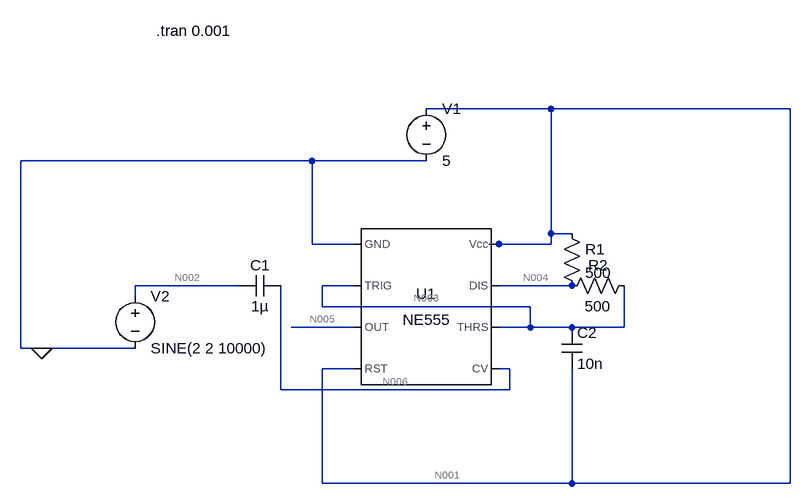
[diagram p0: schematic Draft10.asc]
Draft10.asc, the LTspice schematic file:
Version 4
SHEET 1 1044 680
WIRE 672 -32 480 -32
WIRE 1040 -32 672 -32
WIRE 304 48 -144 48
WIRE 480 48 304 48
WIRE 672 160 672 -32
WIRE 704 160 672 160
WIRE 304 176 304 48
WIRE 368 176 304 176
WIRE 592 176 576 176
WIRE 672 176 672 160
WIRE 672 176 592 176
WIRE 192 240 32 240
WIRE 368 240 320 240
WIRE 704 240 592 240
WIRE 32 256 32 240
WIRE 320 272 320 240
WIRE 640 272 320 272
WIRE 368 304 272 304
WIRE 640 304 640 272
WIRE 640 304 592 304
WIRE 704 304 640 304
WIRE 784 304 784 240
WIRE 784 304 704 304
WIRE -144 336 -144 48
WIRE -112 336 -144 336
WIRE 32 336 -112 336
WIRE 368 368 320 368
WIRE 608 368 592 368
WIRE 256 400 256 240
WIRE 608 400 608 368
WIRE 608 400 256 400
WIRE 320 544 320 368
WIRE 704 544 704 368
WIRE 704 544 320 544
WIRE 1040 544 1040 -32
WIRE 1040 544 704 544
FLAG -112 336 0
SYMBOL Misc/NE555 480 272 R0
SYMATTR InstName U1
SYMBOL voltage 480 -48 R0
SYMATTR InstName V1
SYMATTR Value 5
SYMBOL voltage 32 240 R0
SYMATTR InstName V2
SYMATTR Value SINE(2 2 10000)
SYMBOL cap 256 224 R90
WINDOW 0 0 32 VBottom 2
WINDOW 3 32 32 VTop 2
SYMATTR InstName C1
SYMATTR Value 1µ
SYMBOL res 688 144 R0
SYMATTR InstName R1
SYMATTR Value 500
SYMBOL cap 688 304 R0
SYMATTR InstName C2
SYMATTR Value 10n
SYMBOL res 800 224 R90
WINDOW 0 0 56 VBottom 2
WINDOW 3 32 56 VTop 2
SYMATTR InstName R2
SYMATTR Value 500
TEXT 64 -152 Left 2 !.tran 0.001

The netlist it stands for:
* Draft10.asc
XU1 0 N003 N005 N001 N006 N003 N004 N001 NE555  ; pins GND TRIG OUT RST CV THRS DIS Vcc
V1 N001 0 5
V2 N002 0 SINE(2 2 10000)
C1 N006 N002 1µ
R1 N001 N004 500
C2 N003 N001 10n
R2 N003 N004 500
.tran 0.001
.lib NE555.sub
.backanno
.end

* Results of the author's LTspice run, read from the files saved beside the schematic
* Operating Point, zero values left out:
*   V(n003) = 5 V
*   V(n006) = 3.333 V
*   V(n001) = 5 V
*   V(n004) = 5 V
*   V(n005) = 5 V
*   V(n002) = 2 V
*   I(R2) = -10 nA
*   I(R1) = 16.67 nA
*   I(V1) = -1.611 mA
*   Ix(u1:1) = -1.611 mA
*   Ix(u1:2) = 5 nA
*   Ix(u1:4) = 22.67 µA
*   Ix(u1:6) = 5 nA
*   Ix(u1:7) = 6.672 nA
*   Ix(u1:8) = 1.588 mA
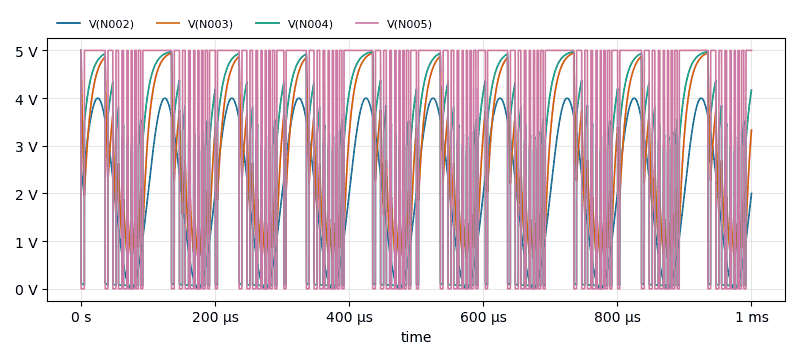
[diagram p1: Transient Analysis of Draft10.asc, plotted from the saved traces]
* Transient Analysis, 1 run:
*   V(N002): min 82.08 µV, max 3.998 V, average 2 V, rms 2.449 V, last 2 V
*   V(N003): min 654.5 mV, max 5 V, average 2.705 V, rms 3.035 V, last 3.33 V
*   V(N004): min 66.28 mV, max 5 V, average 2.696 V, rms 3.349 V, last 4.165 V
*   V(N005): min 30 µV, max 5 V, average 3.219 V, rms 4.009 V, last 5 V